# Altium schematic sheet IsolatedPWM.SchDoc
size A4
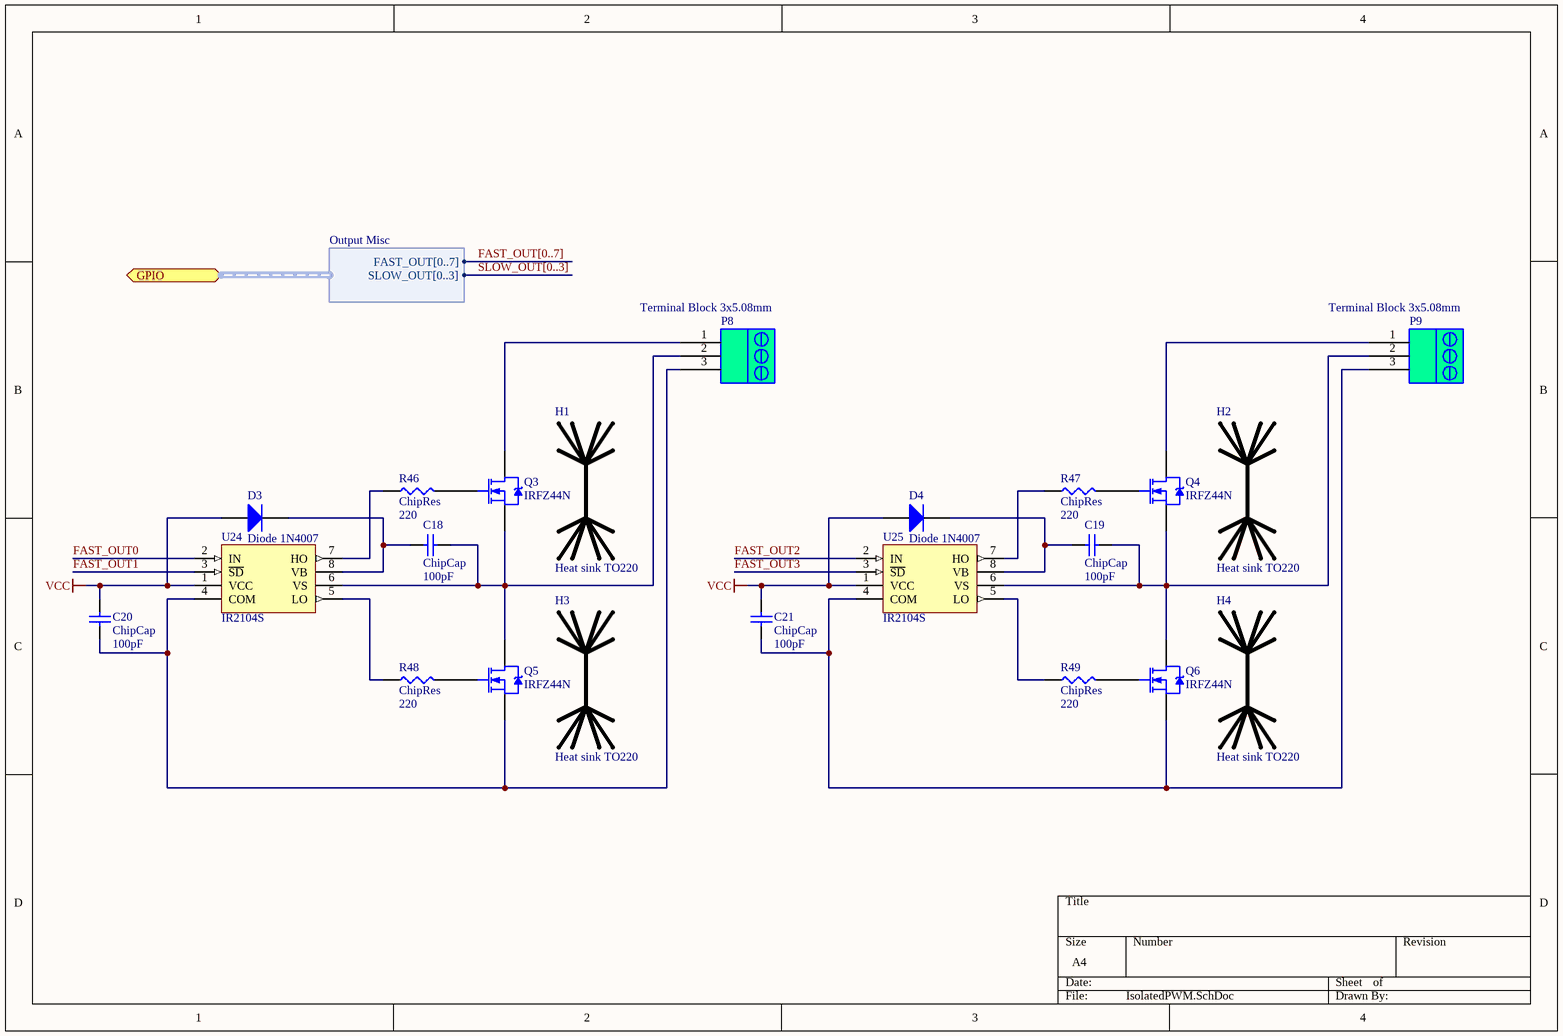
[diagram p0: IsolatedPWM.SchDoc]

## Parts
C18  ChipCap  value 100pF  [CAP1206]
C19  ChipCap  value 100pF  [CAP1206]
C20  ChipCap  value 100pF  [CAP0805]
C21  ChipCap  value 100pF  [CAP0805]
D3  Diode 1N4007  [DO-41]
D4  Diode 1N4007  [DO-41]
H1  Heat sink TO220  [HeatSink_TO220]
H2  Heat sink TO220  [HeatSink_TO220]
H3  Heat sink TO220  [HeatSink_TO220]
H4  Heat sink TO220  [HeatSink_TO220]
P8  Terminal Block 3x5.08mm  [Socket 3x5.08]
P9  Terminal Block 3x5.08mm  [Socket 3x5.08]
Q3  IRFZ44N  [TO-220AB]
Q4  IRFZ44N  [TO-220AB]
Q5  IRFZ44N  [TO-220AB]
Q6  IRFZ44N  [TO-220AB]
R46  ChipRes  value 220  [RES0805]
R47  ChipRes  value 220  [RES0805]
R48  ChipRes  value 220  [RES0805]
R49  ChipRes  value 220  [RES0805]
U24  IR2104S  [SO-8_N]
U25  IR2104S  [SO-8_N]

## Ports
GPIO (harness Output Misc)

## Harnesses
Output Misc: FAST_OUT[0..7], SLOW_OUT[0..3]

## Nets
VCC: C20.2 C21.2 D3.1(A) D4.1(A) U24.1(VCC) U25.1(VCC)
FAST_OUT0: U24.2(IN)
FAST_OUT1: U24.3(~{SD})
FAST_OUT2: U25.2(IN)
FAST_OUT3: U25.3(~{SD})
NetC18_1: C18.1 P8.2 Q3.3(S) Q5.2(D) U24.6(VS)
NetC18_2: C18.2 D3.2(K) U24.8(VB)
NetC19_1: C19.1 P9.2 Q4.3(S) Q6.2(D) U25.6(VS)
NetC19_2: C19.2 D4.2(K) U25.8(VB)
NetC20_1: C20.1 P8.3 Q5.3(S) U24.4(COM)
NetC21_1: C21.1 P9.3 Q6.3(S) U25.4(COM)
NetP8_1: P8.1 Q3.2(D)
NetP9_1: P9.1 Q4.2(D)
NetQ3_1: Q3.1(G) R46.2
NetQ4_1: Q4.1(G) R47.2
NetQ5_1: Q5.1(G) R48.2
NetQ6_1: Q6.1(G) R49.2
NetR46_1: R46.1 U24.7(HO)
NetR47_1: R47.1 U25.7(HO)
NetR48_1: R48.1 U24.5(LO)
NetR49_1: R49.1 U25.5(LO)

## Buses and harness runs
bus FAST_OUT[0..7]
bus SLOW_OUT[0..3]

## Library data of the parts
C18-C21 = ChipCap: Capacitor; Published: 8-Jun-2000; LatestRevisionDate: 17-Jul-2002; LatestRevisionNote: Re-released for DXP Platform.; PackageReference: RAD-0.3; Publisher: Altium Limited
D3 D4 = Diode 1N4007: 1 Amp General Purpose Rectifier; Published: 8-Jun-2000; LatestRevisionDate: 17-Jul-2002; LatestRevisionNote: Re-released for DXP Platform.; DatasheetVersion: 1998; PackageVersion: Aug-1999; PackageReference: DO-41; Publisher: Altium Limited; PackageDescription: Diode, Axial; Body 5.2 x 2.7 mm (LxDia. max), Lead Dia. 0.86 mm (max); Code_JEDEC: DO-204-AL; ComponentLink1Description: Manufacturer Link; ComponentLink1URL: http://www.fairchildsemi.com/; ComponentLink2Description: Datasheet; ComponentLink2URL: http://www.fairchildsemi.com/ds/1N%2F1N4001.pdf
H1-H4 = HeatSink_TO220
P8 P9 = Socket_3x5.08_RA_2Wall: Terminal Block Socket Right Angle 3x5.08mm 2-Wall
Q3-Q6 = IRFZ44N: HEXFET Power MOSFET; Note: Pin 2 is electrically connected to pin 4.; Published: 8-Jun-2000; LatestRevisionDate: 17-Jul-2002; LatestRevisionNote: Re-released for DXP Platform.; DatasheetVersion: Aug-1997; PackageVersion: Feb-1997; PackageReference: TO-220AB; Publisher: Altium Limited; PackageDescription: TO, Thru-Hole, Vertical, Heatsink Mounted; 3 In-Line Leads; Pitch 2.54 mm; ComponentLink1Description: Manufacturer Link; ComponentLink1URL: http://www.irf.com/; ComponentLink2Description: Datasheet; ComponentLink2URL: http://www.irf.com/product-info/datasheets/data/irfz44n.pdf
R46-R49 = ChipRes: Chip resistor
U24 U25 = IR2104S: High and Low Side Driver; Published: 8-Jun-2000; LatestRevisionDate: 13-Apr-2006; LatestRevisionNote: IPC-7351 Footprint Added.; DatasheetVersion: PD600461; PackageVersion: Feb-2001; PackageReference: SO-8; Publisher: Altium Limited; PackageDescription: 8-Pin Plastic Small Outline Integrated Circuit 1.27 mm Pitch; Code_JEDEC: MS-012-AA; Code_IPC: SOIC127P600-8; ComponentLink1Description: Manufacturer Link; ComponentLink1URL: http://www.irf.com/; ComponentLink2Description: Datasheet; ComponentLink2URL: http://www.irf.com/product-info/datasheets/data/ir2104.pdf